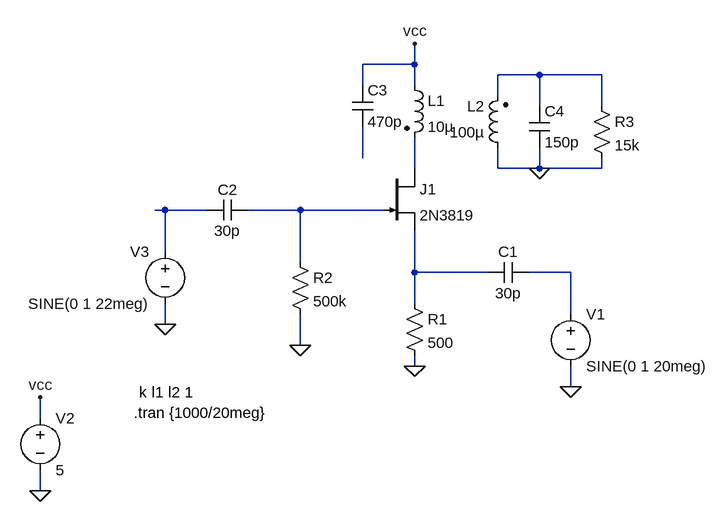
[diagram p0: schematic mixer.asc]
mixer.asc, the LTspice schematic file:
Version 4
SHEET 1 880 680
WIRE 160 -16 160 -48
WIRE 160 -16 80 -16
WIRE 352 0 288 0
WIRE 448 0 352 0
WIRE 80 16 80 -16
WIRE 160 16 160 -16
WIRE 288 32 288 0
WIRE 352 48 352 0
WIRE 448 48 448 0
WIRE 80 128 80 80
WIRE 160 144 160 96
WIRE 288 144 288 112
WIRE 352 144 352 112
WIRE 352 144 288 144
WIRE 448 144 448 128
WIRE 448 144 352 144
WIRE -224 208 -240 208
WIRE -160 208 -224 208
WIRE -16 208 -96 208
WIRE 112 208 -16 208
WIRE -224 272 -224 208
WIRE -16 288 -16 208
WIRE 160 304 160 240
WIRE 272 304 160 304
WIRE 400 304 336 304
WIRE 160 352 160 304
WIRE 400 368 400 304
WIRE -224 384 -224 352
WIRE -16 416 -16 368
WIRE 160 448 160 432
WIRE 400 480 400 448
WIRE -416 528 -416 496
WIRE -416 640 -416 608
FLAG 160 448 0
FLAG 400 480 0
FLAG -416 640 0
FLAG -416 496 vcc
FLAG 160 -48 vcc
FLAG -16 416 0
FLAG -224 384 0
FLAG 352 144 0
SYMBOL njf 112 144 R0
SYMATTR InstName J1
SYMATTR Value 2N3819
SYMBOL res 144 336 R0
SYMATTR InstName R1
SYMATTR Value 500
SYMBOL cap 336 288 R90
WINDOW 0 0 32 VBottom 2
WINDOW 3 32 32 VTop 2
SYMATTR InstName C1
SYMATTR Value 30p
SYMBOL voltage 400 352 R0
WINDOW 123 0 0 Left 0
WINDOW 39 0 0 Left 0
SYMATTR InstName V1
SYMATTR Value SINE(0 1 20meg)
SYMBOL voltage -416 512 R0
WINDOW 123 0 0 Left 0
WINDOW 39 0 0 Left 0
SYMATTR InstName V2
SYMATTR Value 5
SYMBOL res -32 272 R0
SYMATTR InstName R2
SYMATTR Value 500k
SYMBOL ind2 144 0 R0
SYMATTR InstName L1
SYMATTR Value 10µ
SYMATTR Type ind
SYMBOL cap -160 192 M90
WINDOW 0 0 32 VBottom 2
WINDOW 3 32 32 VTop 2
SYMATTR InstName C2
SYMATTR Value 30p
SYMBOL voltage -224 256 M0
WINDOW 123 0 0 Left 0
WINDOW 39 0 0 Left 0
SYMATTR InstName V3
SYMATTR Value SINE(0 1 22meg)
SYMBOL cap 64 16 R0
SYMATTR InstName C3
SYMATTR Value 470p
SYMBOL ind2 304 128 R180
WINDOW 0 36 80 Left 2
WINDOW 3 36 40 Left 2
SYMATTR InstName L2
SYMATTR Value 100µ
SYMATTR Type ind
SYMBOL cap 336 48 R0
SYMATTR InstName C4
SYMATTR Value 150p
SYMBOL res 432 32 R0
SYMATTR InstName R3
SYMATTR Value 15k
TEXT -272 520 Left 2 !.tran {1000/20meg}
TEXT -264 488 Left 2 !k l1 l2 1

The netlist it stands for:
* mixer.asc
J1 N003 N005 N006 2N3819
R1 N006 0 500
C1 N007 N006 30p
V1 N007 0 SINE(0 1 20meg)
V2 vcc 0 5
R2 N005 0 500k
L1 vcc N003 10µ
C2 N004 N005 30p
V3 N004 0 SINE(0 1 22meg)
C3 vcc N002 470p
L2 0 N001 100µ
C4 N001 0 150p
R3 N001 0 15k
.model NJF NJF
.model PJF PJF
.lib standard.jft
.tran {1000/20meg}
k l1 l2 1
.backanno
.end